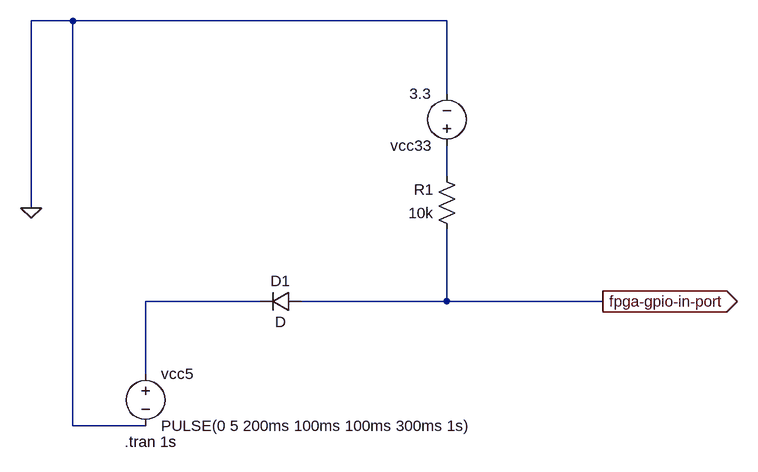
[diagram p0: schematic bread-board-5to33-test02.asc]
bread-board-5to33-test02.asc, the LTspice schematic file:
Version 4
SHEET 1 880 712
WIRE -400 -224 -464 -224
WIRE 176 -224 -400 -224
WIRE 176 -112 176 -224
WIRE 176 16 176 -32
WIRE -464 64 -464 -224
WIRE -112 208 -288 208
WIRE 176 208 176 96
WIRE 176 208 -48 208
WIRE 416 208 176 208
WIRE -288 320 -288 208
WIRE -400 400 -400 -224
WIRE -288 400 -400 400
FLAG 416 208 fpga-gpio-in-port
IOPIN 416 208 Out
FLAG -464 64 0
SYMBOL voltage -288 304 R0
WINDOW 123 0 0 Left 2
WINDOW 39 0 0 Left 2
SYMATTR InstName vcc5
SYMATTR Value PULSE(0 5 200ms 100ms 100ms 300ms 1s)
SYMBOL voltage 176 -16 R180
WINDOW 123 0 0 Left 2
WINDOW 39 0 0 Left 2
SYMATTR InstName vcc33
SYMATTR Value 3.3
SYMBOL res 192 112 R180
WINDOW 0 36 76 Left 2
WINDOW 3 36 40 Left 2
SYMATTR InstName R1
SYMATTR Value 10k
SYMBOL diode -48 192 R90
WINDOW 0 0 32 VBottom 2
WINDOW 3 32 32 VTop 2
SYMATTR InstName D1
TEXT -320 424 Left 2 !.tran 1s

The netlist it stands for:
* bread-board-5to33-test02.asc
vcc5 N002 0 PULSE(0 5 200ms 100ms 100ms 300ms 1s)
vcc33 N001 0 3.3
R1 fpga-gpio-in-port N001 10k
D1 fpga-gpio-in-port N002 D
.model D D
.lib standard.dio
.tran 1s
.backanno
.end